# EAGLE design TracKat Module Breakout (EAGLE 9.6.2)
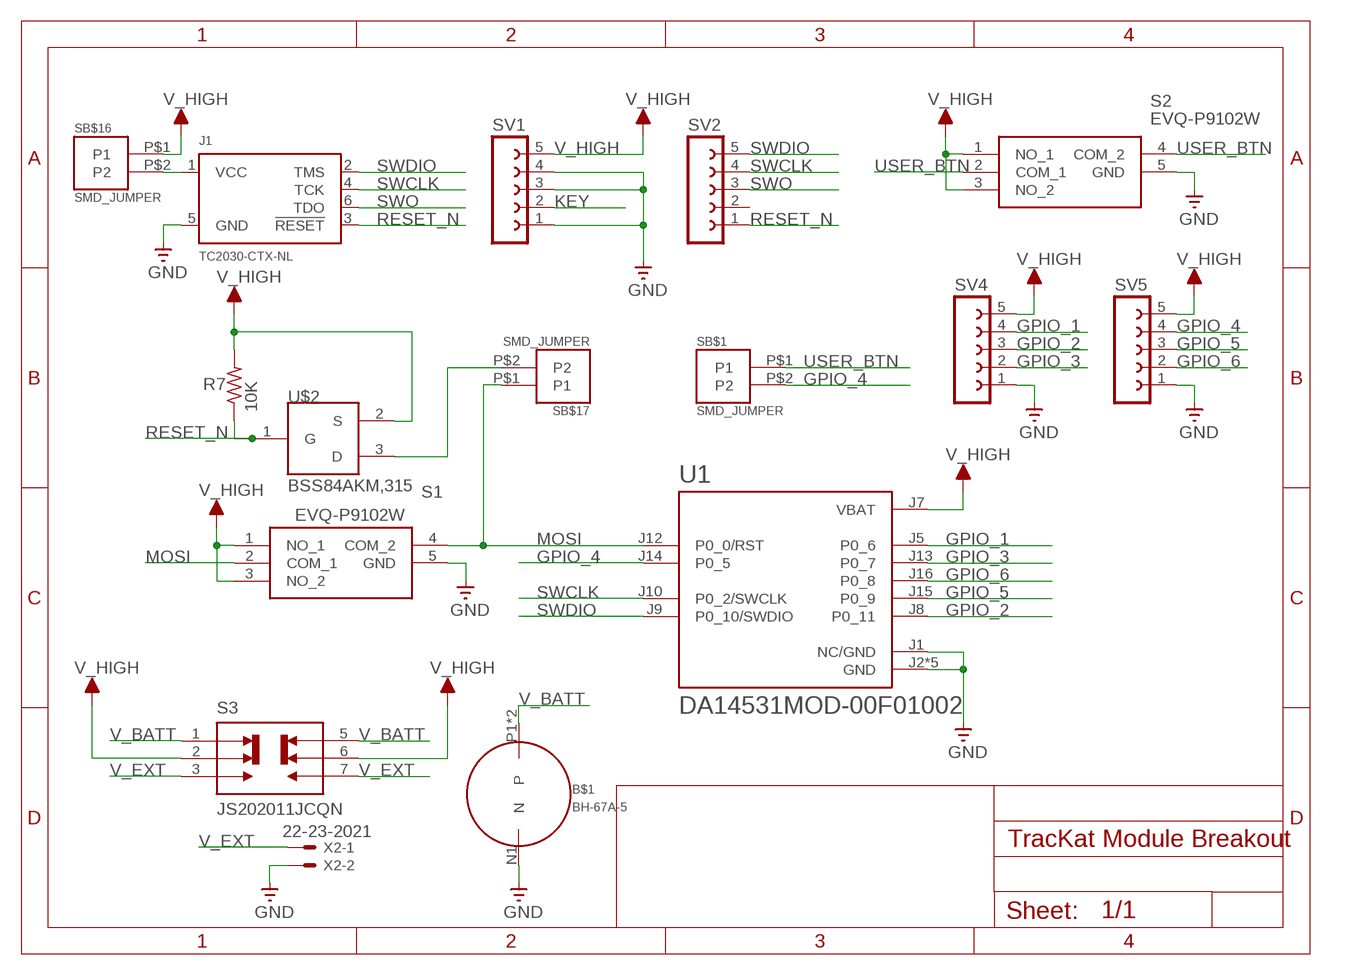
[diagram p0: schematic, sheet 1]

## Parts
B$1  BH-67A-5  [BH-67A-5]
J1  TC2030-CTX-NL  [TC2030-IDC-NL]
R7  10K  R-US_R0603  [R0603]
S1  EVQ-P9102W  [EVQP9102W]
S2  EVQ-P9102W  [EVQP9102W]
S3  JS202011JCQN  [SW_JS202011JCQN]
SB$1  SMD_JUMPER  [SMD_JUMPER]
SB$16  SMD_JUMPER  [SMD_JUMPER]
SB$17  SMD_JUMPER  [SMD_JUMPER]
SV1  FE05-1  [FE05-1]
SV2  FE05-1  [FE05-1]
SV4  FE05-1  [FE05-1]
SV5  FE05-1  [FE05-1]
U1  DA14531MOD-00F01002  [XCVR_DA14531MOD-00F01002]
U$2  BSS84AKM,315  [DFN985X585X50-3N]
X2  22-23-2021  [22-23-2021]

## Nets
GND: B$1.N1(N) J1.5(GND) S1.5(GND) S2.5(GND) SV4.1 SV5.1 U1.J1(NC/GND) U1.J2(GND) U1.J3(GND) U1.J4(GND) U1.J6(GND) U1.J11(GND) X2.2
GPIO_1: SV4.4 U1.J5(P0_6)
GPIO_2: SV4.3 U1.J8(P0_11)
GPIO_3: SV4.2 U1.J13(P0_7)
GPIO_4: SB$1.P$2(P2) SV5.4 U1.J14(P0_5)
GPIO_5: SV5.3 U1.J15(P0_9)
GPIO_6: SV5.2 U1.J16(P0_8)
KEY: SV1.2
MOSI: S1.2(COM_1) S1.4(COM_2) SB$17.P$1(P1) U1.J12(P0_0/RST)
N$15: SV1.1 SV1.3 SV1.4 ; supply symbol labelled GND
N$19: J1.1(VCC) SB$16.P$2(P2)
N$21: SB$17.P$2(P2) U$2.3(D)
RESET_N: J1.3(!RESET) R7.1 SV2.1 U$2.1(G)
SWCLK: J1.4(TCK) SV2.4 U1.J10(P0_2/SWCLK)
SWDIO: J1.2(TMS) SV2.5 U1.J9(P0_10/SWDIO)
SWO: J1.6(TDO) SV2.3
USER_BTN: S2.2(COM_1) S2.4(COM_2) SB$1.P$1(P1)
V_BATT: B$1.P1(P) B$1.P2(P) S3.1 S3.5
V_EXT: S3.3 S3.7 X2.1
V_HIGH: R7.2 S1.1(NO_1) S1.3(NO_2) S2.1(NO_1) S2.3(NO_2) S3.2 S3.6 SB$16.P$1(P1) SV1.5 SV4.5 SV5.5 U1.J7(VBAT) U$2.2(S)
Unconnected: SV2.2

## Library data of the parts
B$1 = Coin Cell Clips:BH-67A-5
J1 = TC2030-CTX:TC2030-CTX: Tag Connect footprint for ARM JTAG. 10 pin ARM Cortex Debug Connector. Check prices <https://pricing.snapeda.com/parts/TC2030-CTX/Tag-Connect%20LLC/view-part?ref=eda>; AVAILABILITY: In Stock; DESCRIPTION: Cortex® Plug-Of-Nails™ Adapter Cable; MF: Tag-Connect LLC; MP: TC2030-CTX; PACKAGE: None; PRICE: None; PURCHASE-URL: https://pricing.snapeda.com/search/part/TC2030-CTX/?ref=eda
R7 = rcl:R-US_: RESISTOR, American symbol; SPICEPREFIX: R
S1 S2 = EVQ-P9102W:EVQ-P9102W: Tactile Switches 4.7x3.52.5mm 4N With Grnd Term Source: Datasheet <https://industrial.panasonic.com/cdbs/www-data/pdf/ATK0000/ATK0000C374.pdf>; ARROW_PART_NUMBER: EVQ-P9102W; ARROW_PRICE-STOCK: https://www.arrow.com/en/products/evq-p9102w/panasonic; DESCRIPTION: Tactile Switches 4.7x3.52.5mm 4N With Grnd Term; HEIGHT: 2.5mm; MANUFACTURER_NAME: Panasonic; MANUFACTURER_PART_NUMBER: EVQ-P9102W; MOUSER_PART_NUMBER: 667-EVQ-P9102W; MOUSER_PRICE-STOCK: https://www.mouser.co.uk/ProductDetail/Panasonic/EVQ-P9102W?qs=PzGy0jfpSMvUc6TfsFZ%2Fsg%3D%3D
S3 = JS202011JCQN:JS202011JCQN: Slide Switch DPDT Surface Mount; DESCRIPTION: Slide Switch DPDT Surface Mount; DIGI-KEY_PART_NUMBER: CKN10723CT-ND; MF: C&K; MP: JS202011JCQN; PACKAGE: DPDT-6 C&amp;K; PURCHASE-URL: https://pricing.snapeda.com/search/part/JS202011JCQN/?ref=eda
SB$1 SB$16 SB$17 = Solder_Jumpers:SMD_JUMPER
SV1 SV2 SV4 SV5 = con-lsta:FE05-1: FEMALE HEADER; OC_FARNELL: unknown; OC_NEWARK: unknown
U1 = DA14531MOD-00F01002:DA14531MOD-00F01002: Dialog Bluetooth Low Energy module; DESCRIPTION: Bluetooth Bluetooth v5.1 Transceiver Module 2.4GHz ~ 2.4835GHz Integrated, Trace Surface Mount; DIGI-KEY_PART_NUMBER: 1695-DA14531MOD-00F01002CT-ND; MF: Dialog Semiconductor GmbH; MP: DA14531MOD-00F01002; PACKAGE: SMD-16 Dialog Semiconductor; PURCHASE-URL: https://pricing.snapeda.com/search/part/DA14531MOD-00F01002/?ref=eda
U$2 = DFN985X585X50-3N:BSS84AKM,315
X2 = con-molex:22-23-2021: .100" (2.54mm) Center Header - 2 Pin; MF: MOLEX; MPN: 22-23-2021; OC_FARNELL: 1462926; OC_NEWARK: 25C3832

## Board
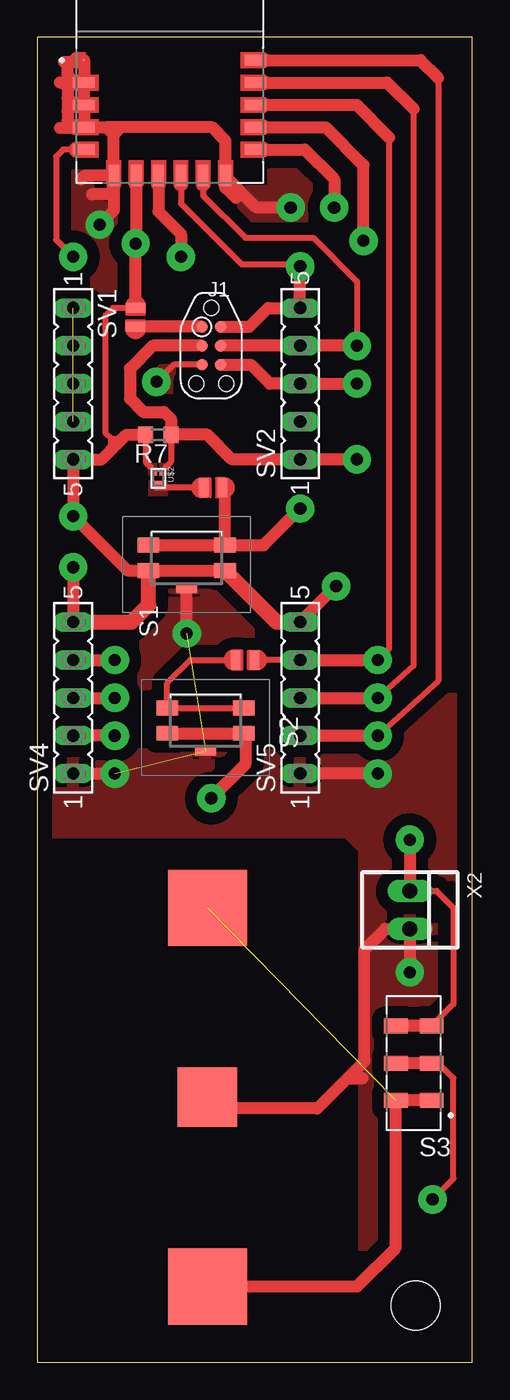
[diagram p1: board, top side]
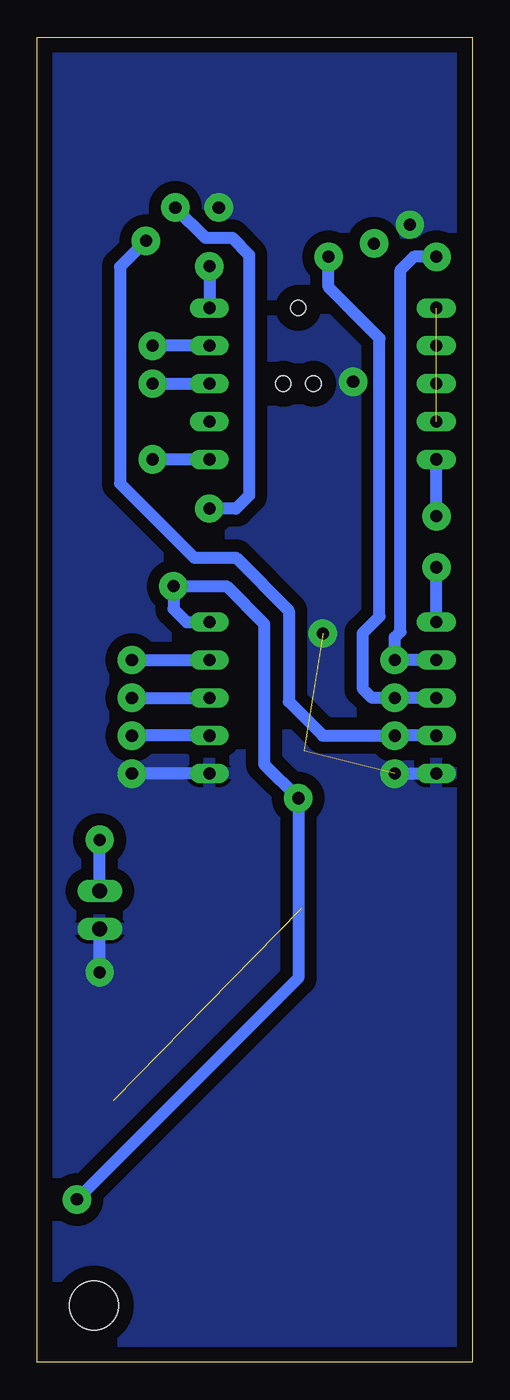
[diagram p2: board, bottom side, seen from below]

Size 29.21 x 88.9 mm. Coordinates in mm from the lower left corner, seen from the top.
Outline: 0,0 29.21,0 29.21,88.9 0,88.9 0,0
Copper layers (1*16): Top 0.035mm / dielectric 1.5mm / Bottom 0.035mm
Design rules "default *": minimum track width 6mil, minimum drill 32mil, track to track 6mil, track to pad 6mil, pad to pad 6mil, via to via 6mil, smd to smd 6mil, copper to edge 40mil, drill to drill 6mil, minimum pad ring 10mil, minimum via ring 8mil, stop-mask expansion 4mil, vias tented up to drill 0mil, thermal gap 10mil
Holes 3.3 mm at 25.4,3.81

### Footprints (pad centres in the part's own frame; a part is rotated, then mirrored left to right if it is on the bottom)
BH-67A-5 = smd 3.988 x 3.988: N1 0,0 | smd 5.105 x 5.309: P1 -12.7,0; P2 12.7,0
TC2030-IDC-NL = smd 0.787 x 0.787: 1 -1.27,-0.635; 2 -1.27,0.635; 3 0,-0.635; 4 0,0.635; 5 1.27,-0.635; 6 1.27,0.635 | hole 1.016: -2.54,0; 2.54,1.016; 2.54,-1.016
R0603 = smd 1 x 1.1: 1 -0.85,0; 2 0.85,0
EVQP9102W = smd 1 x 1.45: 1 -0.85,2.575; 2 0.85,2.575; 3 -0.85,-2.575; 4 0.85,-2.575 | smd 0.65 x 1.4: 5 -2.025,0
SW_JS202011JCQN = smd 1.6 x 1: 1 -1.2,2.5; 2 -1.2,0; 3 -1.2,-2.5; 5 1.2,2.5; 6 1.2,0; 7 1.2,-2.5
SMD_JUMPER = smd 1.27 x 0.635: P$1 0,0.635; P$2 0,-0.635
FE05-1 = drill 0.813 long: 1 -5.08,0; 2 -2.54,0; 3 0,0; 4 2.54,0; 5 5.08,0
XCVR_DA14531MOD-00F01002 = smd 0.1 x 0.1: J1 -5.75,1 | smd 1.422 x 0.711: J2 -5.75,-0.5; J3 -5.75,-2; J4 -5.75,-3.5; J5 -5.75,-5; J12 5.75,-5; J13 5.75,-3.5; J14 5.75,-2; J15 5.75,-0.5; J16 5.75,1 | smd 0.711 x 1.422: J6 -3.75,-6.75; J7 -2.25,-6.75; J8 -0.75,-6.75; J9 0.75,-6.75; J10 2.25,-6.75; J11 3.75,-6.75
DFN985X585X50-3N = smd 0.29 x 0.18: 1 -0.325,0.175; 2 -0.325,-0.175 | smd 0.29 x 0.53: 3 0.325,0
22-23-2021 = drill 1 long: 1 -1.27,0; 2 1.27,0

### Placement (x,y rotation side)
B$1  11.43,17.78 270 top
J1  11.68,68.2 270 top
R7  8.13,62.23 180 top
S1  10.03,53.98 90 top
S2  11.3,43.05 90 top
S3  25.27,20.07 180 top
SB$1  13.97,47.12 90 top
SB$16  6.6,70.1 0 top
SB$17  11.81,58.67 270 top
SV1  2.41,65.66 270 top
SV2  17.65,65.66 90 top
SV4  2.41,44.58 90 top
SV5  17.65,44.58 90 top
U1  8.89,86.36 0 top
U$2  8.13,59.31 270 top
X2  25.02,30.35 270 top

### Tracks (layer width: path | path; a pad name or v marks a point on that pad's centre or on a via)
GND  (via drill 0.81 pad 1.91)  (2 unrouted)
  Top 0.406: J1.5 9.14,66.93 v8,65.79 | 10.03,51.69 S1.5
  Top 0.813: U1.J2 U1.J1 3.03,87.25 1.78,87.25 2.03,87 2.03,86.36 | U1.J3 U1.J2 | U1.J3 U1.J4 | U1.J4 4.64,82.86 | U1.J6 5.14,82.36 | 4.64,82.86 5.14,82.36 | U1.J11 12.64,81.97 11.76,82.86 5.64,82.86 | 5.64,82.86 4.64,82.86 | 5.14,82.36 5.64,82.86 | U1.J6 5.14,78.74 | 5.14,78.74 5.14,77.28 v4.19,76.33 | v17.02,77.47 14.73,77.47 12.64,79.56 U1.J11 | v10.03,48.9 10.03,51.69 | v22.86,39.5 SV5.1 | SV4.1 v5.21,39.5 | 12.45,16.76 B$1.N1 12.19,17.02 18.8,17.02 20.83,19.05 | 20.83,19.05 21.97,20.19 21.97,27.69 23.37,29.08 X2.2 | X2.2 24.08,29.08 | 20.83,19.05 21.84,19.05 | X2.2 v25.02,26.16 | U1.J4 3.08,82.8 2.03,82.8 | 2.03,82.8 1.52,82.8 | 2.03,85.86 1.53,85.86 1.52,85.85 | 2.03,85.86 2.03,86.36 | U1.J2 2.03,85.86 | 2.03,85.86 2.03,85.47 | 2.03,85.47 2.03,84.84 | 2.03,84.84 2.03,83.95 | 2.03,83.95 2.03,83.31 | 2.03,83.31 2.03,82.8 | U1.J4 2.48,82.86 2.03,83.31 | U1.J3 2.44,84.36 2.03,83.95 | U1.J3 2.51,84.36 2.03,84.84 | U1.J2 2.53,85.86 2.03,86.36 | U1.J2 2.42,85.86 2.03,85.47 | U1.J6 3.16,79.61 2.92,79.38 | 5.14,78.74 4.76,78.36 3.68,78.36 | U1.J11 12.64,78.8 13.34,78.11
  Bottom 0.813: SV5.1 v22.86,39.5 | v5.21,39.5 SV4.1 | v25.02,26.16 X2.2
  pour Bottom (isolate 0.813): 0,88.9 29.21,88.9 29.21,0 0,0
  pour Top (isolate 0.813): 0,88.77 4.32,88.77 4.32,78.61 15.88,78.61 15.88,81.41 29.21,81.41 29.21,-0.13 21.97,-0.13 21.97,34.42 20.83,35.56 0,35.56
GPIO_1  (via drill 0.81 pad 1.91)
  Top 0.406: U1.J5 1.73,81.36 1.27,80.9 1.27,75.31 v2.41,74.17
  Top 0.813: SV4.4 v5.21,47.12
  Bottom 0.813: v2.41,74.17 3.94,74.17 4.83,73.28 4.83,49.02 5.21,48.64 v5.21,47.12 SV4.4
GPIO_2  (via drill 0.81 pad 1.91)
  Top 0.813: U1.J8 8.14,77.2 9.65,75.69 v9.65,74.17 | SV4.3 v5.21,44.58
  Bottom 0.813: v9.65,74.17 9.65,72.14 6.22,68.71 6.22,50.04 7.37,48.9 7.37,45.21 6.73,44.58 v5.21,44.58 SV4.3
GPIO_3  (via drill 0.81 pad 1.91)
  Top 0.813: v21.91,75.25 21.91,80.33 19.38,82.86 U1.J13 | v5.21,42.04 SV4.2
  Bottom 0.813: SV4.2 v5.21,42.04 10.03,42.04 12.32,44.32 12.32,50.42 15.88,53.98 18.67,53.98 23.66,58.97 23.66,73.5 v21.91,75.25
GPIO_4  (via drill 0.81 pad 1.91)
  Top 0.406: SV5.4 SB$1.P$2 | 23.62,82.17 23.62,47.88 v22.86,47.12
  Top 0.813: U1.J14 21.43,84.36 23.62,82.17 | SV5.4 v22.86,47.12
  Bottom 0.813: v22.86,47.12 SV5.4
GPIO_5  (via drill 0.81 pad 1.91)
  Top 0.406: v22.86,44.58 25.27,46.74 25.27,84.07
  Top 0.813: U1.J15 23.49,85.86 25.27,84.07 | SV5.3 v22.86,44.58
  Bottom 0.813: v22.86,44.58 SV5.3
GPIO_6  (via drill 0.81 pad 1.91)
  Top 0.406: 26.92,86.17 26.92,45.72 v22.86,42.04
  Top 0.813: U1.J16 25.73,87.36 26.92,86.17 | SV5.2 v22.86,42.04
  Bottom 0.813: SV5.2 v22.86,42.04
MOSI  (via drill 0.81 pad 1.91)
  Top 0.813: S1.2 S1.4 | U1.J12 17.95,81.36 19.94,79.38 v19.94,77.47 | S1.4 15.2,54.83 v17.65,57.28 | S1.4 12.61,58.51 SB$17.P$1
  Bottom 0.813: v19.94,77.47 17.91,75.44 16.13,75.44 14.99,74.3 14.99,58.17 15.88,57.28 v17.65,57.28
N$15  (2 unrouted)
N$19
  Top 0.813: J1.1 SB$16.P$2
N$21
  Top 0.152: 8,58.67 8,58.86 U$2.3
  Top 0.406: SB$17.P$2 8,58.67
  pour Top (no thermals): 8.76,59.11 7.49,59.11 7.49,58.17 8.76,58.17
RESET_N  (via drill 0.81 pad 1.91)
  Top 0.152: 8.64,60.07 8.3,59.74 U$2.1
  Top 0.406: 8.64,60.07 8.98,60.41 R7.1 9.02,62.27
  Top 0.813: v21.46,60.58 SV2.1 13.08,60.58 11.43,62.23 R7.1 8.98,63.28 8.51,63.75 7.11,63.75 6.22,64.64 6.22,66.67 7.75,68.2 J1.3
  Bottom 0.813: SV2.1 v21.46,60.58
  pour Top (no thermals): 8.76,60.33 8.76,59.51 8.26,59.51 8.26,60.33
SWCLK  (via drill 0.81 pad 1.91)
  Top 0.406: v21.46,68.2 21.46,72.52 18.54,75.44 13.97,75.44 11.14,78.27 U1.J10
  Top 0.813: v21.46,68.2 SV2.4 J1.4
  Bottom 0.813: SV2.4 v21.46,68.2
SWDIO  (via drill 0.81 pad 1.91)
  Top 0.406: U1.J9 9.64,77.74 13.72,73.66 17.53,73.66 v17.65,73.53 | 14.22,69.47 14.29,69.53
  Top 0.813: v17.65,73.53 SV2.5 15.49,70.74 14.29,69.53 | J1.2 14.22,69.47
  Bottom 0.813: v17.65,73.53 SV2.5
SWO  (via drill 0.81 pad 1.91)
  Top 0.813: v21.46,65.66 SV2.3 15.62,65.66 14.35,66.93 J1.6
  Bottom 0.813: v21.46,65.66 SV2.3
USER_BTN
  Top 0.406: S2.4 S2.2 8.73,45.56 10.29,47.12 SB$1.P$1
V_BATT  (1 unrouted)
  Top 0.813: B$1.P1 12.41,31.46 | S3.1 S3.5 24.07,7.69 21.46,5.08 B$1.P2
V_EXT  (via drill 0.81 pad 1.91)
  Top 0.406: X2.1 26.8,31.62 27.94,30.48 27.94,24.03 S3.3
  Top 0.813: S3.3 S3.7 | v25.02,35.05 X2.1
  Bottom 0.813: X2.1 v25.02,35.05
V_HIGH  (via drill 0.81 pad 1.91)
  Top 0.152: 7.62,60.07 7.95,59.74 U$2.2
  Top 0.406: R7.2 7.28,60.41 7.62,60.07 | v6.6,75.06 6.64,75.09 6.64,74.84 | SB$16.P$1 5.08,70.74 4.57,70.23 4.57,62.36 4.95,61.98 | 4.95,61.98 5.33,61.59 | 4.95,61.21 4.95,61.98 | 4.95,61.98 5.59,61.98 5.65,61.91 | v26.54,10.92 27.94,12.32 27.94,19.05 26.92,20.07 S3.2
  Top 0.813: S1.3 S1.1 6.06,53.12 v2.41,56.77 SV1.5 4.32,60.58 4.95,61.21 5.33,61.59 5.65,61.91 5.97,62.23 R7.2 | U1.J7 6.64,75.09 | SB$16.P$1 6.6,74.8 6.64,74.84 | v2.41,53.34 SV4.5 | SV5.5 v20.07,52.07 | S2.1 S2.3 13.97,42.11 13.97,40.13 v11.68,37.85 | S3.2 S3.6
  Top 1.016: S1.3 16.08,49.66 SV5.5 | SV4.5 6.35,49.66 7.49,50.8 7.49,53.09 S1.1
  Bottom 0.813: v2.41,56.77 SV1.5 | SV4.5 v2.41,53.34 | SV5.5 19.18,49.66 20.07,50.55 v20.07,52.07 16.51,52.07 13.97,49.53 13.97,40.13 v11.68,37.85 11.68,25.78 v26.54,10.92
  pour Top (no thermals): 8,60.33 8,59.51 7.49,59.51 7.49,60.33